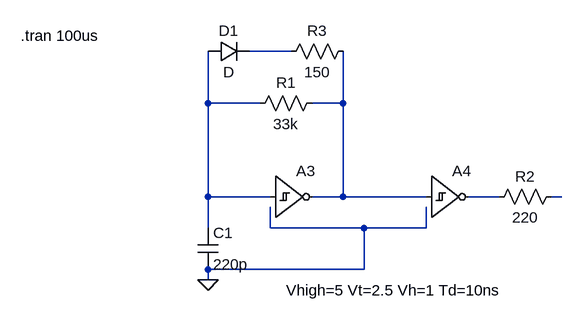
[diagram p0: schematic TDR.asc]
TDR.asc, the LTspice schematic file:
Version 4
SHEET 1 880 680
WIRE 128 128 64 128
WIRE 0 208 0 128
WIRE 80 208 0 208
WIRE 208 208 208 128
WIRE 208 208 160 208
WIRE 0 352 0 208
WIRE 96 352 0 352
WIRE 208 352 208 208
WIRE 208 352 160 352
WIRE 336 352 208 352
WIRE 448 352 400 352
WIRE 544 352 528 352
WIRE 0 400 0 352
WIRE 96 400 96 368
WIRE 240 400 96 400
WIRE 336 400 336 368
WIRE 336 400 240 400
WIRE 240 464 240 400
WIRE 240 464 0 464
WIRE 0 480 0 464
FLAG 0 480 0
SYMBOL cap -16 400 R0
SYMATTR InstName C1
SYMATTR Value 220p
SYMBOL res 176 192 R90
WINDOW 0 0 56 VBottom 2
WINDOW 3 32 56 VTop 2
SYMATTR InstName R1
SYMATTR Value 33k
SYMBOL res 544 336 R90
WINDOW 0 0 56 VBottom 2
WINDOW 3 32 56 VTop 2
SYMATTR InstName R2
SYMATTR Value 220
SYMBOL schmtinv 96 288 R0
SYMATTR InstName A3
SYMATTR SpiceLine Vhigh=5 Vt=2.5 Vh=1 Td=10ns
SYMBOL schmtinv 336 288 R0
SYMATTR InstName A4
SYMATTR SpiceLine Vhigh=5 Vt=2.5 Vh=1 Td=10ns
SYMBOL diode 0 144 R270
WINDOW 0 32 32 VTop 2
WINDOW 3 0 32 VBottom 2
SYMATTR InstName D1
SYMBOL res 224 112 R90
WINDOW 0 0 56 VBottom 2
WINDOW 3 32 56 VTop 2
SYMATTR InstName R3
SYMATTR Value 150
TEXT -288 104 Left 2 !.tran 100us
TEXT 120 496 Left 2 !Vhigh=5 Vt=2.5 Vh=1 Td=10ns

The netlist it stands for:
* TDR.asc
C1 N002 0 220p
R1 N003 N002 33k
R2 N005 N004 220
A3 N002 0 0 0 0 N003 0 0 SCHMITT Vhigh=5 Vt=2.5 Vh=1 Td=10ns
A4 N003 0 0 0 0 N004 0 0 SCHMITT Vhigh=5 Vt=2.5 Vh=1 Td=10ns
D1 N002 N001 D
R3 N003 N001 150
.model D D
.lib standard.dio
.tran 100us
Vhigh=5 Vt=2.5 Vh=1 Td=10ns
.backanno
.end